# EAGLE design samd11-breakout-for-milling (EAGLE 8.7.1)
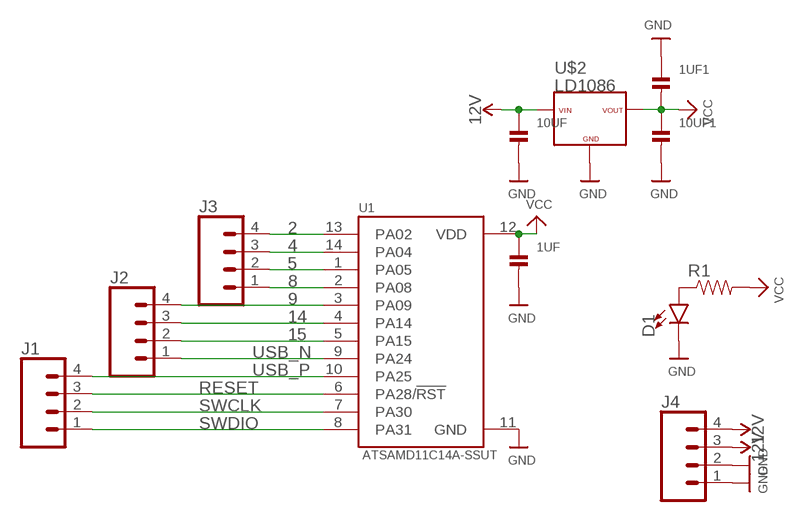
[diagram p0: schematic, sheet 1]

## Parts
1UF  CAP_CERAMIC0603  [0603]
1UF1  CAP_CERAMIC0603  [0603]
10UF  CAP_CERAMIC0805  [0805]
10UF1  CAP_CERAMIC0805  [0805]
D1  LED5MM-KIT  [LED_5MM-KIT]
J1  CONN_04SMD_RA_FEMALE  [1X04_SMD_RA_FEMALE]
J2  CONN_04SMD_RA_FEMALE  [1X04_SMD_RA_FEMALE]
J3  CONN_04SMD_RA_FEMALE  [1X04_SMD_RA_FEMALE]
J4  CONN_04SMD_RA_FEMALE  [1X04_SMD_RA_FEMALE]
R1  RESISTOR1206  [1206]
U1  ATSAMD11C14A-SSUT  [SOIC127P600X160-14N]
U$2  LD1086  [D2PAK]

## Nets
2: J3.4 U1.13(PA02)
4: J3.3 U1.14(PA04)
5: J3.2 U1.1(PA05)
8: J3.1 U1.2(PA08)
9: J2.4 U1.3(PA09)
12V: 10UF.1 J4.3 J4.4 U$2.VIN
14: J2.3 U1.4(PA14)
15: J2.2 U1.5(PA15)
GND: 1UF1.1 1UF.2 10UF1.2 10UF.2 D1.K(C) J4.1 J4.2 U1.11(GND) U$2.GND
N$1: D1.A R1.1
RESET: J1.3 U1.6(PA28/!RST)
SWCLK: J1.2 U1.7(PA30)
SWDIO: J1.1 U1.8(PA31)
USB_N: J2.1 U1.9(PA24)
USB_P: J1.4 U1.10(PA25)
VCC: 1UF1.2 1UF.1 10UF1.1 R1.2 U1.12(VDD) U$2.VOUT

## Library data of the parts
1UF 1UF1 10UF 10UF1 = microbuilder:CAP_CERAMIC: Ceramic Capacitors 0402 - 0402 Surface Mount Capacitors 16pF 50V 5% [Digikey: 445-4899-2-ND] 18pF 50V 5% [Digikey: 490-1281-2-ND] 22pF 50V 5% [Digikey: 490-1283-2-ND] 68pF 50V 5% [Digikey: 490-1289-2-ND] 0.1uF 10V 10% [Digikey: 490-1318-2-ND] 1.0uF 6.3V 10% [Digikey: 490-1320-2-ND] 0603 - 0603 Surface Mount Capacitors 16 pF 50V 5% [Digikey: 445-5051-2-ND] 22 pF 50V [Digikey: PCC220ACVTR-ND] 33 pF 50V 5% [Digikey: 490-1415-1-ND] 56pF 50V 5% [Digikey: 490-1421-1-ND] 220pF 50V 5% [Digikey: 445-1285-1-ND] 680 pF 50V 2200 pF 50V 5% C0G [Digikey: 445-1297-1-ND] 5600 pF 100V 5% X7R [Digikey: 478-3711-1-ND] 0.1 µF 25V 10% [Digikey: PCC2277TR-ND] 0.22 µF 16V 10% X7R [Digikey: 445-1318-1-ND] 1.0 µF 25V 10% [Digikey: 445-5146-2-ND] 0603 - RF Specific 3pF 250V +/-0.1pF RF [Digikey: 712-1347-1-ND] 18 pF 250V 5% [Digikey: 478-3505-1-ND or 712-1322-1-ND] 56 pF 250V 5% C0G RF [Digikey: 490-4867-1-ND] 68 pF 250V RF [Digikey: 490-4868-1-ND] 0805 - 0805 Surface Mount Capacitors 220 pF 250V 2% RF Ceramic Capacitor [Digikey: 712-1398-1-ND] 1000 pF 50V 2% NP0 Ceramic Capacitor [Digikey: 478-3760-1-ND] 0.1 µF 25V 10% Ceramic Capacitor [Digikey: PCC1828TR-ND] 1.0 µF 16V 10% Ceramic Capacitor[Digikey: 490-1691-2-ND] 10.0 µF 10V 10% Ceramic Capacitor[Digikey: 709-1228-1-ND] 10.0 uF 16V 10% Ceramic Capacitor [Digikey: 478-5165-2-ND] 47 uF 6.3V 20% Ceramic Capacitor [Digikey: 587-1779-1-ND or 399-5506-1-ND] 1206 - 1206 Surface Mount Capacitors 47uF 10V 20% Ceramic Capacitor [Digikey: 490-5528-1-ND or 399-5508-1-ND or 445-6010-1-ND] 100uF 6.3V -20%, +80% Y5V Ceramic Capacitor (Digikey: 490-4512-1-ND, Mouser: 81-GRM31CF50J107ZE1L)
D1 = SparkFun-LED:LED: LED (Generic) Standard schematic elements and footprints for 5mm, 3mm, 1206, and 0603 sized LEDs. Generic LEDs with no color specified.
J1-J4 = SparkFun-Connectors:CONN_04: Multi connection point. Often used as Generic Header-pin footprint for 0.1 inch spaced/style header connections On any of the 0.1 inch spaced packages, you can populate with these: Break Away Headers - Straight <https://www.sparkfun.com/products/116> (PRT-00116) Break Away Male Headers - Right Angle <https://www.sparkfun.com/products/553> (PRT-00553) Female Headers <https://www.sparkfun.com/products/115> (PRT-00115) Break Away Headers - Machine Pin <https://www.sparkfun.com/products/117> (PRT-00117) Break Away Female Headers - Swiss Machine Pin <https://www.sparkfun.com/products/743> (PRT-00743) For SCREWTERMINALS and SPRING TERMINALS visit here: Screw Terimnals on SparkFun.com <https://www.sparkfun.com/search/results?term=Screw+Terminals> (5mm/3.5mm/2.54mm spacing) This device is also useful as a general connection point to wire up your design to another part of your project. Our various solder wires solder well into these plated through hole pads. Hook-Up Wire - Assortment (Stranded, 22 AWG) <https://www.sparkfun.com/products/11375> (PRT-11375) Hook-Up Wire - Assortment (Solid Core, 22 AWG) <https://www.sparkfun.com/products/11367> (PRT-11367) View the entire wire category on our website here <https://www.sparkfun.com/categories/141> Special notes: Molex polarized connector foot print use with SKU : PRT-08231 with associated crimp pins and housings. 1MM SMD Version SKU: PRT-10208; PROD_ID: CONN-12382
R1 = SparkFun-Passives:RESISTOR: Resistor Basic schematic elements and footprints for 0603, 1206, and PTH resistors.
U1 = ATSAMD11C14A-SSUT:ATSAMD11C14A-SSUT: MCU 32-Bit SAM D11 ARM Cortex M0+ RISC 16KB Flash 1.8V/2.5V/3.3V 14-Pin SOIC T/R; AVAILABILITY: Good; DESCRIPTION: Cortex-M0+, 16KB FLASH, 4KB SRAM, USB - 14 SOIC, INDUSTRIAL, GREEN, 1.6-3.6V, 48MHz/ SOIC .150 (SS); MF: Microchip; MP: ATSAMD11C14A-SSUT; PACKAGE: SOIC-14 Microchip; PRICE: 1.18 USD
U$2 = LD1086:LD1086; AVAILABILITY: Unavailable; DESCRIPTION: Semiconductors and Actives; MF: STMicroelectronics; MP: LD1086; PACKAGE: None; PRICE: None

## Board
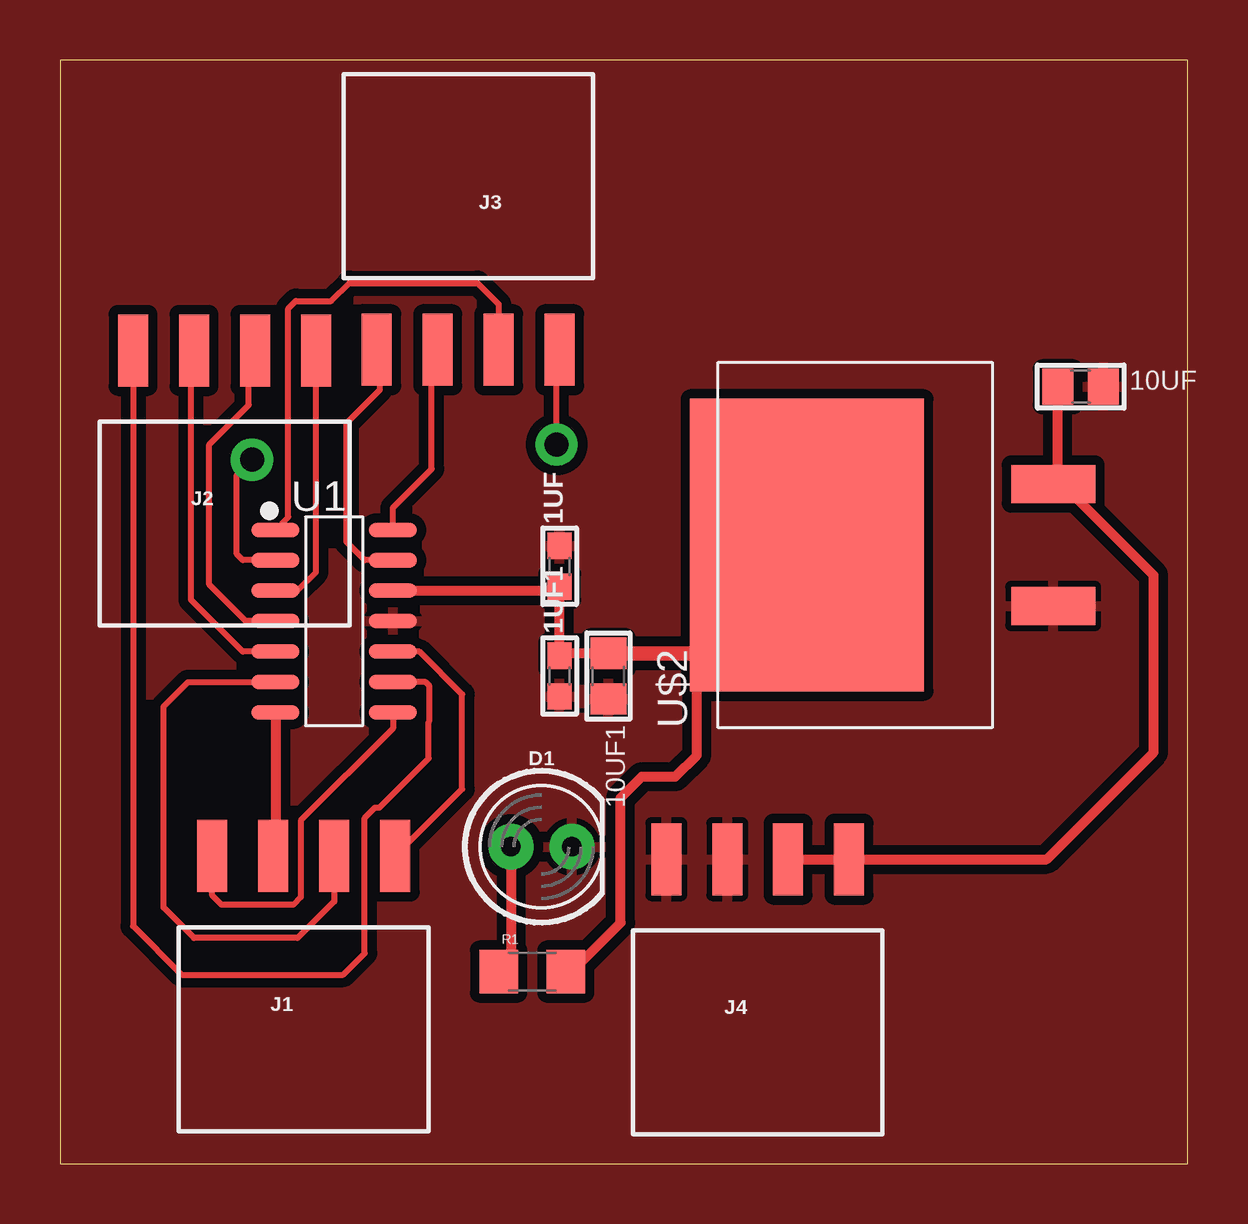
[diagram p1: board, top side]
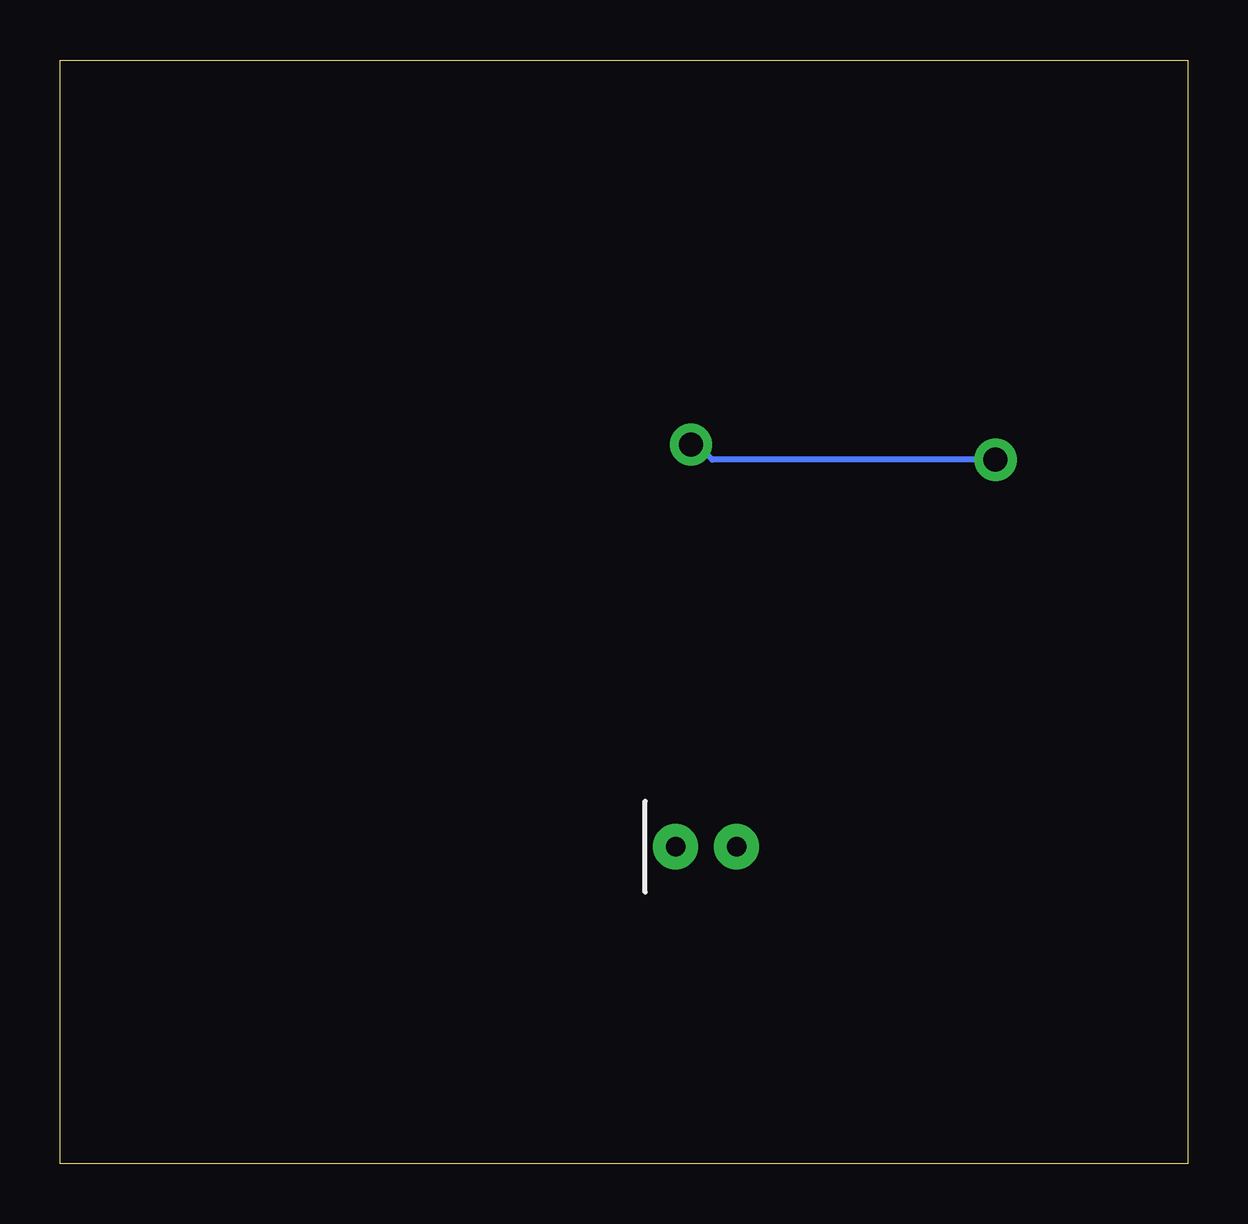
[diagram p2: board, bottom side, seen from below]

Size 47 x 46 mm. Coordinates in mm from the lower left corner, seen from the top.
Outline: 0,0 47,0 47,46 0,46 0,0
Copper layers (1*16): Top 0.035mm / dielectric 1.5mm / Bottom 0.035mm
Design rules "OthermillDRC_1_64_v2": minimum track width 16mil, minimum drill 31mil, track to track 0.39878125mm, track to pad 0.39878125mm, pad to pad 0.39878125mm, via to via 0.39878125mm, smd to smd 0mil, copper to edge 0mil, drill to drill 1mil, minimum pad ring 0mil, minimum via ring 15mil, stop-mask expansion 1mil, vias tented up to drill 30mil, thermal gap 10mil

### Footprints (pad centres in the part's own frame; a part is rotated, then mirrored left to right if it is on the bottom)
0603 = smd 1.1 x 1: 1 -0.85,0; 2 0.85,0
0805 = smd 1.3 x 1.5: 1 -0.95,0; 2 0.95,0
LED_5MM-KIT = drill 0.813 pad 1.88: A -1.27,0; K 1.27,0
1X04_SMD_RA_FEMALE = smd 1.25 x 3: 1 -3.81,7.225; 2 -1.27,7.225; 3 1.27,7.225; 4 3.81,7.225
1206 = smd 1.6 x 1.8: 1 -1.4,0; 2 1.4,0
SOIC127P600X160-14N = smd 2 x 0.6: 1 -2.45,3.81; 2 -2.45,2.54; 3 -2.45,1.27; 4 -2.45,0; 5 -2.45,-1.27; 6 -2.45,-2.54; 7 -2.45,-3.81; 8 2.45,-3.81; 9 2.45,-2.54; 10 2.45,-1.27; 11 2.45,0; 12 2.45,1.27; 13 2.45,2.54; 14 2.45,3.81
D2PAK = smd 1.6 x 3.505: GND -2.54,-2.54; VIN 2.54,-2.54 | smd 12.192 x 9.754: VOUT 0,7.722

### Placement (x,y rotation side)
1UF  20.83,24.89 90 top
1UF1  20.83,20.32 90 top
10UF  42.55,32.38 0 top
10UF1  22.86,20.32 270 top
D1  20.07,13.21 0 top
J1  10.16,5.59 0 top
J2  6.86,26.67 0 top
J3  17.02,41.15 180 top
J4  29.08,5.46 0 top
R1  19.68,8 0 top
U1  11.43,22.61 0 top
U$2  38.86,25.78 90 top

### Tracks (layer width: path | path; a pad name or v marks a point on that pad's centre or on a via)
2
  Top 0.254: U1.13 12.7,25.15 11.94,25.91 11.94,30.86 13.34,32.26 13.34,33.8 J3.4
4
  Top 0.254: U1.14 13.88,27.34 15.49,28.96 15.49,33.67 J3.3
5
  Top 0.254: U1.1 9.52,26.95 9.52,35.64 9.82,35.95 11.31,35.95 12.06,36.7 17.4,36.7 18.29,35.81 J3.2
8  (via drill 1)
  Top 0.254: U1.2 7.62,25.15 7.37,25.4 7.37,28.7 v8,29.34 | v20.7,29.97 20.7,33.8 J3.1
  Bottom 0.254: v8,29.34 19.81,29.34 20.7,30.23 v20.7,29.97
9
  Top 0.254: U1.3 9.91,23.88 10.67,24.64 J2.4
12V
  Top 0.406: 41.59,28.51 10UF.1 | 41.59,28.51 U$2.VIN | J4.3 J4.4 41.13,12.69 45.59,17.14 45.59,24.52 41.59,28.51
14
  Top 0.254: U1.4 7.75,22.61 6.22,24.13 6.22,29.97 7.87,31.62 7.87,33.64 J2.3
15
  Top 0.254: U1.5 7.62,21.34 5.46,23.5 5.46,33.77 J2.2
GND
  pour Top: -19.81,-10.67 121.16,-10.67 121.16,81.79 -40.13,81.79 -40.13,-10.67
N$1
  Top 0.406: D1.A 18.8,8.51 R1.1
RESET
  Top 0.254: J1.3 11.43,10.92 9.91,9.4 5.59,9.4 4.32,10.67 4.32,19.05 5.33,20.07 U1.6
SWCLK
  Top 0.406: U1.7 8.98,12.9 J1.2
SWDIO
  Top 0.254: U1.8 13.88,18.13 10.04,14.29 10.04,11.1 9.73,10.79 6.74,10.79 6.35,11.18 J1.1
USB_N
  Top 0.254: J2.1 3.05,9.91 5.08,7.87 11.81,7.87 12.7,8.76 12.7,14.41 13.13,14.84 13.31,14.84 15.37,16.89 15.37,18.41 15.41,18.45 15.41,19.9 15.24,20.07 U1.9
USB_P
  Top 0.254: J1.4 16.76,15.61 16.76,19.56 14.99,21.34 U1.10
VCC
  Top 0.305: U1.12 20.66,23.88 1UF.1 | 20.83,23.74 20.83,21.36 1UF1.2 20.93,21.27 10UF1.1
  Top 0.406: 10UF1.1 20.91,21.27 20.83,21.36 | 1UF1.2 20.83,23.74 | 20.83,23.74 1UF.1 | U1.12 20.69,23.88 20.83,23.74 | R1.2 21.34,8 23.37,10.03 23.37,15.24 24.26,16.13 25.65,16.13 26.54,17.02 26.54,20.12 27.7,21.27
  Top 0.61: 10UF1.1 27.7,21.27 31.33,21.27 U$2.VOUT